# Altium schematic sheet rgbController.SchDoc
size A
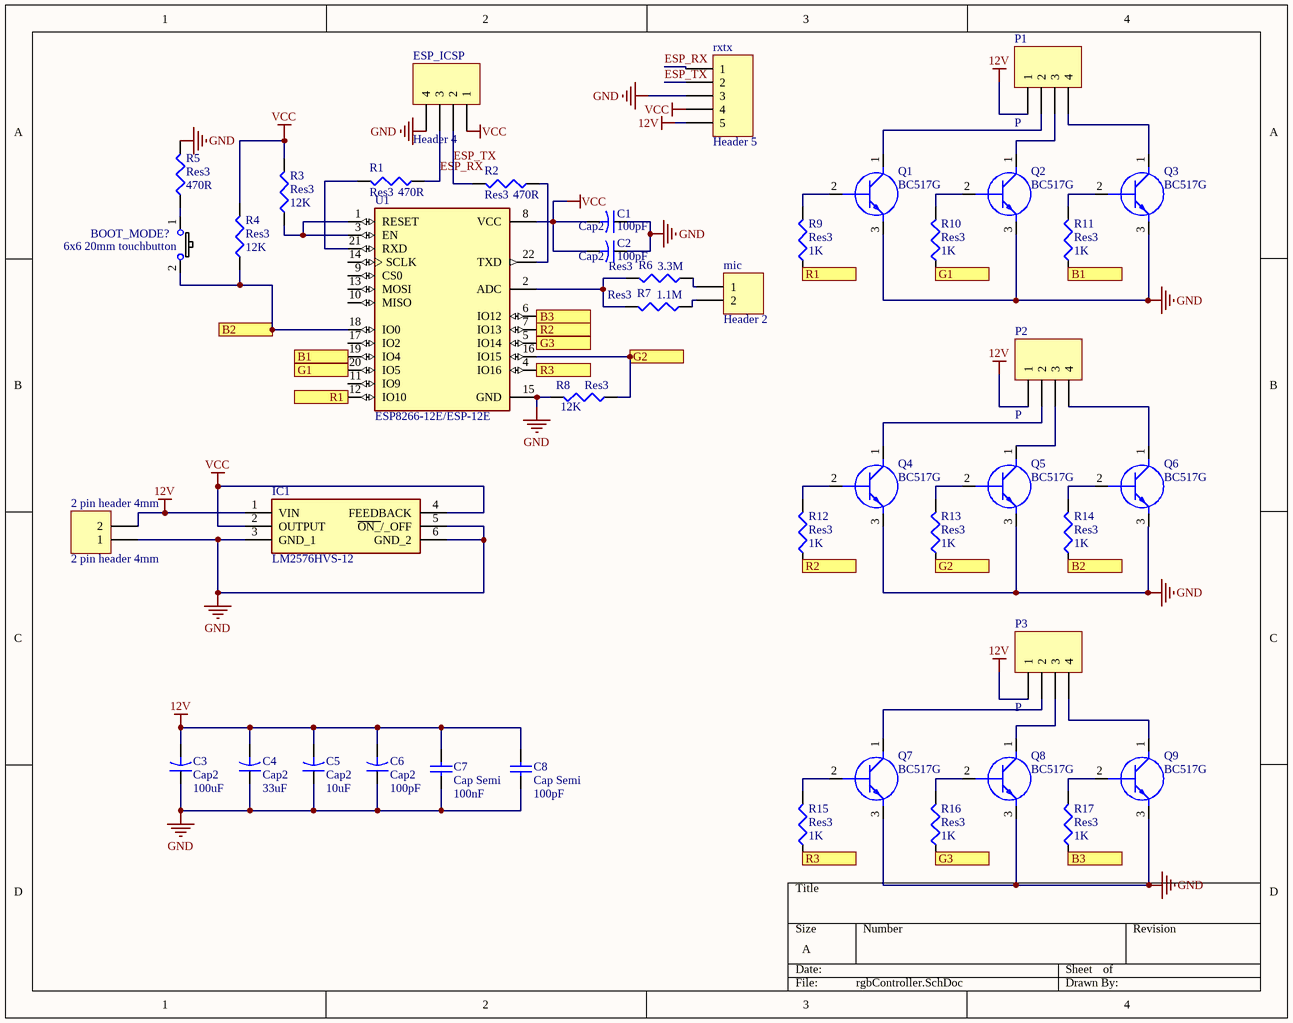
[diagram p0: rgbController.SchDoc]

## Parts
2_pin_header_4mm  2 pin header 4mm  [2 pin header 4mm]
BOOT_MODE?  6x6 20mm touchbutton  [6x6 20mm touchbutton]
C1  Cap2  value 100pF  [CAPR5-4X5]
C2  Cap2  value 100pF  [CAPR5-4X5]
C3  Cap2  value 100uF  [CAPR5-4X5]
C4  Cap2  value 33uF  [CAPR5-4X5]
C5  Cap2  value 10uF  [CAPR5-4X5]
C6  Cap2  value 100pF  [CAPR5-4X5]
C7  Cap Semi  value 100nF  [1608[0603]]
C8  Cap Semi  value 100pF  [1608[0603]]
ESP_ICSP  Header 4  [HDR1X4]
IC1  LM2576HVS-12  [KTT0005B]
mic  Header 2  [HDR1X2]
P1  P  [4 pin header 4mm]
P2  P  [4 pin header 4mm]
P3  P  [4 pin header 4mm]
Q1  BC517G  [TO-92_(TO-226)]
Q2  BC517G  [TO-92_(TO-226)]
Q3  BC517G  [TO-92_(TO-226)]
Q4  BC517G  [TO-92_(TO-226)]
Q5  BC517G  [TO-92_(TO-226)]
Q6  BC517G  [TO-92_(TO-226)]
Q7  BC517G  [TO-92_(TO-226)]
Q8  BC517G  [TO-92_(TO-226)]
Q9  BC517G  [TO-92_(TO-226)]
R1  Res3  value 470R  [J1-0603]
R2  Res3  value 470R  [J1-0603]
R3  Res3  value 12K  [J1-0603]
R4  Res3  value 12K  [J1-0603]
R5  Res3  value 470R  [J1-0603]
R6  Res3  value 3.3M  [J1-0603]
R7  Res3  value 1.1M  [J1-0603]
R8  Res3  value 12K  [J1-0603]
R9  Res3  value 1K  [J1-0603]
R10  Res3  value 1K  [J1-0603]
R11  Res3  value 1K  [J1-0603]
R12  Res3  value 1K  [J1-0603]
R13  Res3  value 1K  [J1-0603]
R14  Res3  value 1K  [J1-0603]
R15  Res3  value 1K  [J1-0603]
R16  Res3  value 1K  [J1-0603]
R17  Res3  value 1K  [J1-0603]
rxtx  Header 5  [HDR1X5]
U1  ESP8266-12E/ESP-12E  [XCVR_ESP8266-12E/ESP-12E]

## Ports
B1, B2, B3, G1, G2, G3, R1, R2, R3

## Nets
12V: 2_pin_header_4mm.2 C3.2 C4.2 C5.2 C6.2 C7.2 C8.2 IC1.1(VIN) P1.1 P2.1 P3.1 rxtx.5
GND: 2_pin_header_4mm.1 C1.1 C2.1 C3.1 C4.1 C5.1 C6.1 C7.1 C8.1 ESP_ICSP.4 IC1.3(GND_1) IC1.5(~{ON_}/_OFF) IC1.6(GND_2) Q1.3(E) Q2.3(E) Q3.3(E) Q4.3(E) Q5.3(E) Q6.3(E) Q7.3(E) Q8.3(E) Q9.3(E) R5.2 R8.2 rxtx.3 U1.15(GND)
VCC: C1.2 C2.2 ESP_ICSP.1 IC1.2(OUTPUT) IC1.4(FEEDBACK) R3.2 R4.2 rxtx.4 U1.8(VCC)
B1: R11.1 U1.19(IO4) ; port B1
B2: BOOT_MODE?.2 R4.1 R14.1 U1.18(IO0) ; port B2
B3: R17.1 U1.6(IO12) ; port B3
ESP_RX: ESP_ICSP.3 R1.1 rxtx.1
ESP_TX: ESP_ICSP.2 R2.2 rxtx.2
G1: R10.1 U1.20(IO5) ; port G1
G2: R8.1 R13.1 U1.16(IO15) ; port G2
G3: R16.1 U1.5(IO14) ; port G3
R1: R9.1 U1.12(IO10) ; port R1
R2: R12.1 U1.7(IO13) ; port R2
R3: R15.1 U1.4(IO16) ; port R3
NetBOOT_MODE?_1: BOOT_MODE?.1 R5.1
Netmic_1: mic.1 R6.1
Netmic_2: mic.2 R7.1
NetP1_2: P1.2 Q1.1(C)
NetP1_3: P1.3 Q2.1(C)
NetP1_4: P1.4 Q3.1(C)
NetP2_2: P2.2 Q4.1(C)
NetP2_3: P2.3 Q5.1(C)
NetP2_4: P2.4 Q6.1(C)
NetP3_2: P3.2 Q7.1(C)
NetP3_3: P3.3 Q8.1(C)
NetP3_4: P3.4 Q9.1(C)
NetQ1_2: Q1.2(B) R9.2
NetQ2_2: Q2.2(B) R10.2
NetQ3_2: Q3.2(B) R11.2
NetQ4_2: Q4.2(B) R12.2
NetQ5_2: Q5.2(B) R13.2
NetQ6_2: Q6.2(B) R14.2
NetQ7_2: Q7.2(B) R15.2
NetQ8_2: Q8.2(B) R16.2
NetQ9_2: Q9.2(B) R17.2
NetR1_2: R1.2 U1.21(RXD)
NetR2_1: R2.1 U1.22(TXD)
NetR3_1: R3.1 U1.1(RESET) U1.3(EN)
NetR6_2: R6.2 R7.2 U1.2(ADC)

Not connected (* = marked no-connect by the designer): U1 9(CS0) 10(MISO) 11(IO9) 13(MOSI) 14(SCLK) 17(IO2)

## Library data of the parts
C1-C3 = Cap2: Capacitor; Published: 23-Sep-2002; PackageReference: CAPR5-4X5; Publisher: Altium Limited; PackageDescription: Capacitor; 2 Leads
C4 = Cap2_1: Capacitor; Published: 23-Sep-2002; PackageReference: CAPR5-4X5; Publisher: Altium Limited; PackageDescription: Capacitor; 2 Leads
C5 = Cap2_2: Capacitor; Published: 23-Sep-2002; PackageReference: CAPR5-4X5; Publisher: Altium Limited; PackageDescription: Capacitor; 2 Leads
C6 = Cap2_3: Capacitor; Published: 23-Sep-2002; PackageReference: CAPR5-4X5; Publisher: Altium Limited; PackageDescription: Capacitor; 2 Leads
C7 = Cap Semi_1: Capacitor (Semiconductor SIM Model); Published: 8-Jun-2000; LatestRevisionDate: 29-May-2009; LatestRevisionNote: IPC-7351 Footprint Added.; PackageReference: C1206; Publisher: Altium Limited; PackageDescription: Chip Capacitor
C8 = Cap Semi: Capacitor (Semiconductor SIM Model); Published: 8-Jun-2000; LatestRevisionDate: 29-May-2009; LatestRevisionNote: IPC-7351 Footprint Added.; PackageReference: C1206; Publisher: Altium Limited; PackageDescription: Chip Capacitor
ESP_ICSP = Header 4: Header, 4-Pin; LatestRevisionDate: 17-Jul-2002; LatestRevisionNote: Re-released for DXP Platform.; Publisher: Altium Limited
IC1 = LM2576HVS-12: Integrated Circuit; Manufacturer_Name: Texas Instruments; Datasheet Link: http://www.ti.com/lit/ds/symlink/lm2576.pdf; Manufacturer_Part_Number: LM2576HVS-12; Mouser Part Number: 926-LM2576HVS-12; Mouser Price/Stock: https://www.mouser.co.uk/ProductDetail/Texas-Instruments/LM2576HVS-12?qs=X1J7HmVL2ZG26yVYlinkCQ%3D%3D; Arrow Part Number: LM2576HVS-12; Arrow Price/Stock: https://www.arrow.com/en/products/lm2576hvs-12/texas-instruments?region=nac
mic = Header 2: Header, 2-Pin; LatestRevisionDate: 17-Jul-2002; LatestRevisionNote: Re-released for DXP Platform.; Publisher: Altium Limited
P1-P3 = 4 pin header 4mm
Q1-Q9 = BC517G: Transistor BJT NPN; Manufacturer_Name: onsemi; Datasheet Link: https://datasheet.datasheetarchive.com/originals/distributors/Datasheets-24/DSA-461072.pdf; Manufacturer_Part_Number: BC517G; Mouser Part Number: 863-BC517G; Mouser Price/Stock: https://www.mouser.com/Search/Refine.aspx?Keyword=863-BC517G
R1-R17 = Res3: Resistor; Published: 8-Jun-2000; LatestRevisionDate: 29-May-2009; LatestRevisionNote: IPC-7351 Footprint Added.; PackageReference: J1-0603; Publisher: Altium Limited; PackageDescription: Chip Resistor
rxtx = Header 5: Header, 5-Pin; LatestRevisionDate: 17-Jul-2002; LatestRevisionNote: Re-released for DXP Platform.; Publisher: Altium Limited
U1 = ESP8266-12E/ESP-12E: This WiFi module has a 32-bit MCU micro and clock speeds supporting 80 MHz or 160 MHz. Supports the RTOS and integrated Wi-Fi MAC/BB/RF/PA/LNA, and has an on-board antenna.; MF: AI-Thinker; Price: None; Package: None; Value: *; MP: ESP8266-12E/ESP-12E; Availability: Unavailable; SnapEDA_Link: https://www.snapeda.com/parts/ESP8266-12E/ESP-12E/AI-Thinker/view-part/106414/?ref=snap